# Altium schematic sheet Sensor_Board.SchDoc
size A3; ApprovedBy: -; CheckedBy: -; Engineer: Nasıf Can PELTEK; Revision: AA; SheetNumber: 5; SheetTotal: 7; releaseDate: -; changeDate: -; Department: Embedded; Size: A3; projeDescription: Wirless Security Dedector; fileName: Sensor_Board.ShcDoc
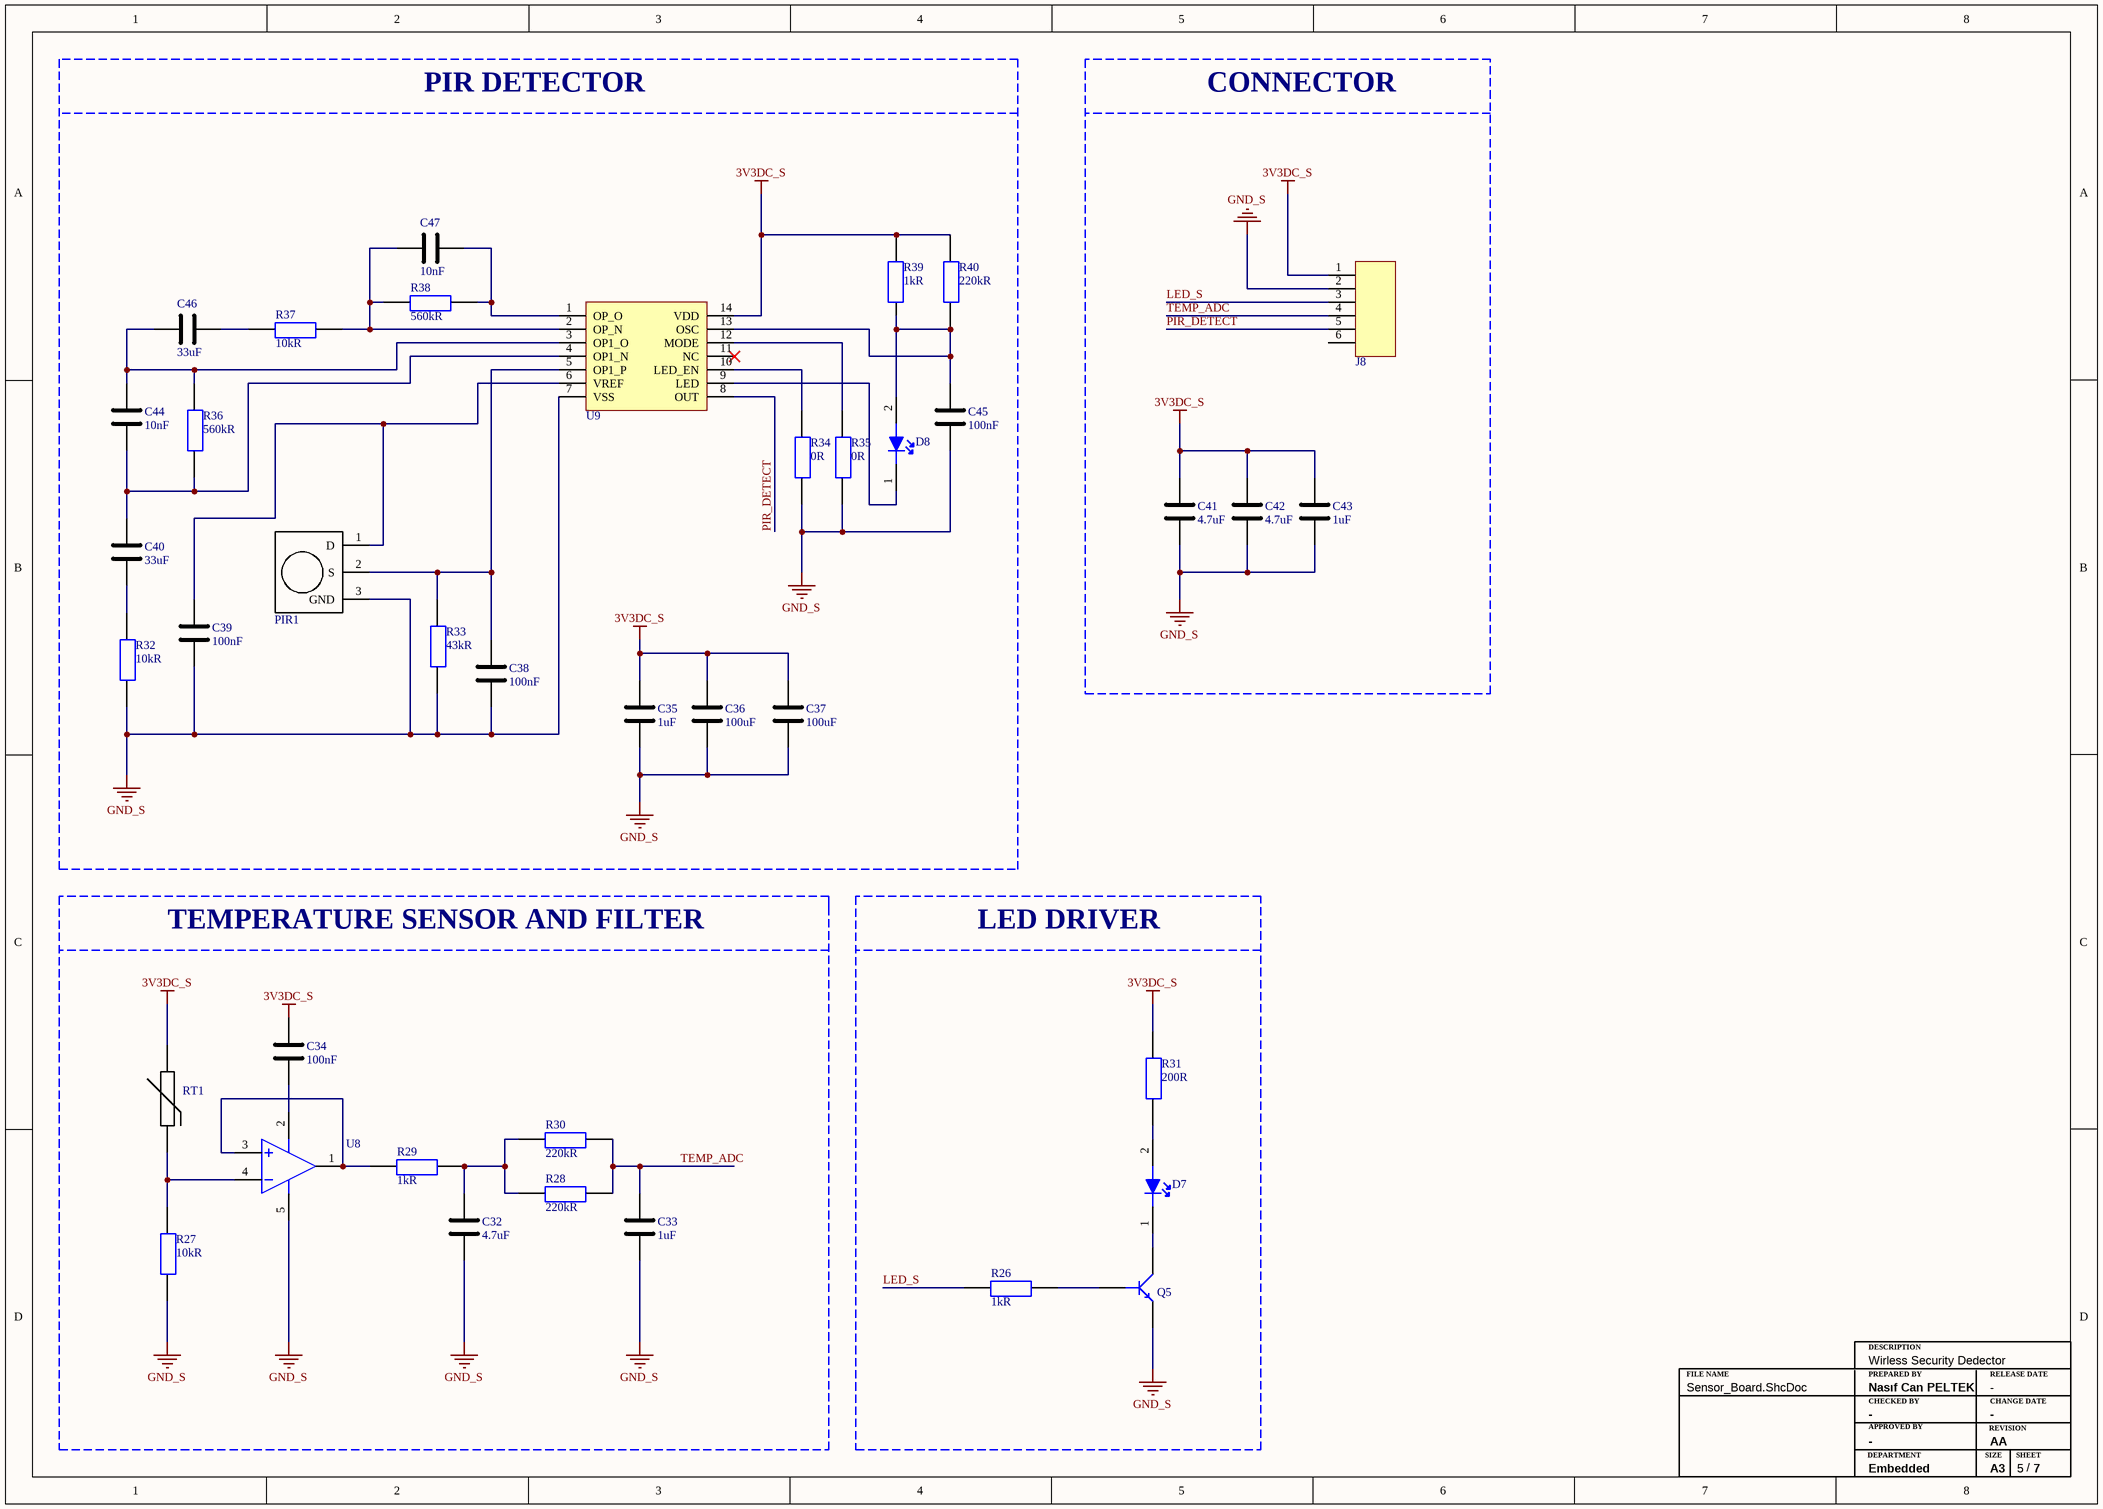
[diagram p0: Sensor_Board.SchDoc]

## Parts
C32  Capacitance: 4.7uF  [CAP_805]  (hidden comment: CL21A475KAQNNNE)
C33  Capacitance: 1uF  [CAP_805]  (hidden comment: CL21B105KBFNNNE)
C34  Capacitance: 100nF  [CAP_603]  (hidden comment: C0603C104K5RAC7867)
C35  Capacitance: 1uF  [CAP_805]  (hidden comment: CL21B105KBFNNNE)
C36  Capacitance: 100uF  [CAP_1206]  (hidden comment: 1210YD107MAT2A)
C37  Capacitance: 100uF  [CAP_1206]  (hidden comment: 1210YD107MAT2A)
C38  Capacitance: 100nF  [CAP_603]  (hidden comment: C0603C104K5RAC7867)
C39  Capacitance: 100nF  [CAP_603]  (hidden comment: C0603C104K5RAC7867)
C40  Capacitance: 33uF  [CAP_1206]  (hidden comment: C3216X5R1C336M160AB)
C41  Capacitance: 4.7uF  [CAP_805]  (hidden comment: CL21A475KAQNNNE)
C42  Capacitance: 4.7uF  [CAP_805]  (hidden comment: CL21A475KAQNNNE)
C43  Capacitance: 1uF  [CAP_805]  (hidden comment: CL21B105KBFNNNE)
C44  Capacitance: 10nF  [CAP_603]  (hidden comment: 0603B103K160CT)
C45  Capacitance: 100nF  [CAP_603]  (hidden comment: C0603C104K5RAC7867)
C46  Capacitance: 33uF  [CAP_1206]  (hidden comment: C3216X5R1C336M160AB)
C47  Capacitance: 10nF  [CAP_603]  (hidden comment: 0603B103K160CT)
D7  LTST-C171KRKT  [LED_RED_0805 (2012 Metric)]  (value not drawn)
D8  LTST-C171GKT  [LED_GREEN_0805 (2012 Metric) - duplicate]  (value not drawn)
J8  64800611622  [MALE_VERTICAL_6_PIN_CONNECTOR]  (value not drawn)
PIR1  LHI 878/3902  [LHI 878/3902]  (value not drawn)
Q5  MMBT3904-7-F  [SOT_23_3]  (value not drawn)
R26  Resistance: 1kR  [RES_603]  (hidden comment: RC0603FR-071KL)
R27  Resistance: 10kR  [RES_603]  (hidden comment: RES 10K 0603)
R28  Resistance: 220kR  [RES_603]  (hidden comment: RC0603JR-07220KL)
R29  Resistance: 1kR  [RES_603]  (hidden comment: RC0603FR-071KL)
R30  Resistance: 220kR  [RES_603]  (hidden comment: RC0603JR-07220KL)
R31  Resistance: 200R  [RES_603]  (hidden comment: RC0603JR-07200RL)
R32  Resistance: 10kR  [RES_603]  (hidden comment: RES 10K 0603)
R33  Resistance: 43kR  [RES_603]  (hidden comment: RC0603JR-0743KL)
R34  Resistance: 0R  [RES_603]  (hidden comment: RC0603JR-070RL)
R35  Resistance: 0R  [RES_603]  (hidden comment: RC0603JR-070RL)
R36  Resistance: 560kR  [RES_603]  (hidden comment: RC0603JR-07560KL)
R37  Resistance: 10kR  [RES_603]  (hidden comment: RES 10K 0603)
R38  Resistance: 560kR  [RES_603]  (hidden comment: RC0603JR-07560KL)
R39  Resistance: 1kR  [RES_603]  (hidden comment: RC0603FR-071KL)
R40  Resistance: 220kR  [RES_603]  (hidden comment: RC0603JR-07220KL)
RT1  TFPT1206L1002FM  [RES_1206]  (value not drawn)
U8  OPA314AIDBVR  [SOT_23_5]  (value not drawn)
U9  NCS36000DRG  [SOIC-14]  (value not drawn)

## Blocks framed on the sheet
PIR DETECTOR: C35-C40 C44-C47 D8 PIR1 R32-R40 U9
CONNECTOR: C41-C43 J8
LED DRIVER: D7 Q5 R26 R31

## Nets
3V3DC_S: C34.2 C35.2 C36.2 C37.2 C41.2 C42.2 C43.2 J8.1 R31.2 R39.1 R40.2 RT1.2 U9.14(VDD)
GND_S: C32.1 C33.1 C35.1 C36.1 C37.1 C38.1 C39.1 C41.1 C42.1 C43.1 C45.1 J8.2 PIR1.3(GND) Q5.2(E) R27.1 R32.1 R33.1 R34.1 R35.1 U8.5(V+) U9.7(VSS)
LED_S: J8.3 R26.1
PIR_DETECT: J8.5 U9.8(OUT)
TEMP_ADC: C33.2 J8.4 R28.2 R30.2
NetC32_2: C32.2 R28.1 R29.2 R30.1
NetC34_1: C34.1 U8.2(V-)
NetC38_2: C38.2 PIR1.2(S) R33.2 U9.5(OP1_P)
NetC39_2: C39.2 PIR1.1(D) U9.6(VREF)
NetC40_1: C40.1 R32.2
NetC40_2: C40.2 C44.1 R36.1 U9.4(OP1_N)
NetC44_2: C44.2 C46.1 R36.2 U9.3(OP1_O)
NetC45_2: C45.2 D8.2(ANODE(+)) R39.2 R40.1 U9.13(OSC)
NetC46_2: C46.2 R37.1
NetC47_1: C47.1 R37.2 R38.1 U9.2(OP_N)
NetC47_2: C47.2 R38.2 U9.1(OP_O)
NetD7_1: D7.1(CATHODE(-)) Q5.3(C)
NetD7_2: D7.2(ANODE(+)) R31.1
NetD8_1: D8.1(CATHODE(-)) U9.9(LED)
NetQ5_1: Q5.1(B) R26.2
NetR27_2: R27.2 RT1.1 U8.4(IN-)
NetR29_1: R29.1 U8.1(OUT) U8.3(IN+)
NetR34_2: R34.2 U9.10(LED_EN)
NetR35_2: R35.2 U9.12(MODE)

Not connected (* = marked no-connect by the designer): J8 6; U9 11(NC)*

## Notes on the sheet
- TEMPERATURE SENSOR AND FILTER
- FILE NAME
- PREPARED BY
- DESCRIPTION
- RELEASE DATE
- DEPARTMENT
- CHECKED BY
- APPROVED BY
- SIZE
- REVISION
- CHANGE DATE
- SHEET
- /

## Library data of the parts
C32 C41 C42 = CAP CER 4.7uF 0805: CAP CER 4.7UF 25V 10% 0805; Manufacturer: Samsung; Designed By: Nasıf Can Peltek; Dielectric: X5R; Supplier 1: Digi-Key; Manufacturer Part Number: CL21A475KAQNNNE; RoHS: Yes; Category: Ceramic Capacitors; Stock 1: 4205254; Pricing 1: 1=0,1, 10=0,073, 50=0,0414, 100=0,0344, 500=0,02408, 1000=0,01994 (USD); Mount: Surface Mount; Case/Package: 0805; Case Code (Metric): 2012; Case Code (Imperial): 0805; Min Operating Temperature: -55°C; Max Operating Temperature: 85°C; Packaging: Tape and Reel; Tolerance: 10%; Voltage Rating: 25V; Voltage Rating (DC): 25V; Series: CL; Construction: Flat; Length: 2mm; Height: 1.25mm; Depth: 1.25mm; Radiation Hardening: No; Lead Free: Lead Free; RoHS Compliant: Yes; ComponentLink1URL: https://datasheet.ciiva.com/25798/cl21a475kaqnnne-25798882.pdf?src-supplier=Digi-Key; ComponentLink1Description: https://datasheet.ciiva.com/25798/cl21a475kaqnnne-25798882.pdf?src-supplier=Digi-Key; Supplier Part Number 1: 1276-1244-1-ND
C33 C35 C43 = CAP CER 1uF 0805: CAP CER 1UF 50V 10% 0805; Manufacturer: Samsung; Designed By: Nasıf Can Peltek; Dielectric: X7R; Supplier 1: Digi-Key; Manufacturer Part Number: CL21B105KBFNNNE; RoHS: Yes; Category: Ceramic Capacitors; Stock 1: 1012576; Pricing 1: 1=0,11, 10=0,079, 50=0,045, 100=0,0373, 500=0,02616, 1000=0,02165 (USD); Mount: Surface Mount; Case/Package: 0805; Case Code (Metric): 2012; Case Code (Imperial): 0805; Min Operating Temperature: -55°C; Max Operating Temperature: 125°C; Tolerance: 10%; Packaging: Tape and Reel; Package Quantity: 1; Voltage Rating: 50V; Voltage: 50V; Series: CL; Construction: Flat; Length: 2mm; Width: 0.049inch; Height: 1.25mm; Thickness: 0.053inch; Depth: 1.25mm; Radiation Hardening: No; RoHS Compliant: Yes; ComponentLink1URL: https://datasheet.ciiva.com/25800/cl21b105kbfnnne-25800291.pdf?src-supplier=Digi-Key; ComponentLink1Description: https://datasheet.ciiva.com/25800/cl21b105kbfnnne-25800291.pdf?src-supplier=Digi-Key; Supplier Part Number 1: 1276-1029-1-ND
C34 C38 C39 C45 = CAP CER 100nF 0603: CAP CER 100nF 50V 10% SMD 0603; Manufacturer: KEMET; Manufacturer Part Number: C0603C104K5RACTU; Designed By: Nasıf Can Peltek; Dielectric Material: Ceramic; Dielectric: X7R; Dissipation Factor: 2.5%; Supplier 1: Digi-Key; RoHS: Yes; Category: Ceramic Capacitors; Stock 1: 12129532; Pricing 1: 1=0,11000, 10=0,07800, 50=0,04240, 100=0,03460, 500=0,02474, 1000=0,01944 (USD); Mount: Surface Mount; Case/Package: 0603; Number of Pins: 2; Case Code (Metric): 1608; Case Code (Imperial): 0603; Contact Plating: Tin,Matte; Min Operating Temperature: -55°C; Max Operating Temperature: 125°C; Tolerance: 10%; Voltage Rating (DC): 50V; Voltage Rating: 50V; Packaging: Tape and Reel; Package Quantity: 1; Termination: SMD/SMT; Voltage: 50V; Series: SMD Comm X7R; Length: 0.063inch; Width: 0.031inch; Height: 0.8mm; Thickness: 0.034inch; Lead Pitch: 0.7mm; Depth: 0.8mm; Radiation Hardening: No; Reach SVHC Compliant: Yes; RoHS Compliant: Yes; ComponentLink1URL: https://datasheet.ciiva.com/7823/kem-c1002-x7r-smd-7823591.pdf?src-supplier=Element14; ComponentLink1Description: https://datasheet.ciiva.com/7823/kem-c1002-x7r-smd-7823591.pdf?src-supplier=Element14; ComponentLink2URL: https://datasheet.ciiva.com/7823/kem-c1002-x7r-smd-7823592.pdf?src-supplier=Element14; ComponentLink2Description: https://datasheet.ciiva.com/7823/kem-c1002-x7r-smd-7823592.pdf?src-supplier=Element14; ComponentLink3URL: https://datasheet.ciiva.com/5999/kem-c1002-x7r-smd-5999400.pdf?src-supplier=Farnell; ComponentLink3Description: https://datasheet.ciiva.com/5999/kem-c1002-x7r-smd-5999400.pdf?src-supplier=Farnell; ComponentLink4URL: https://datasheet.ciiva.com/28645/1851736-28645640.pdf?src-supplier=Element14; ComponentLink4Description: https://datasheet.ciiva.com/28645/1851736-28645640.pdf?src-supplier=Element14; ComponentLink5URL: https://datasheet.ciiva.com/14585/70095383-14585209.pdf?src-supplier=Allied+Electronics; ComponentLink5Description: https://datasheet.ciiva.com/14585/70095383-14585209.pdf?src-supplier=Allied+Electronics; ComponentLink6URL: https://datasheet.ciiva.com/14602/70095383-14602583.pdf?src-supplier=Allied+Electronics; ComponentLink6Description: https://datasheet.ciiva.com/14602/70095383-14602583.pdf?src-supplier=Allied+Electronics; Supplier Part Number 1: 399-C0603C104K5RAC7867CT-ND
C36 C37 = CAP CER 100 uF 1206: CAP CER 100UF 16V 10%1206; Manufacturer: KEMET; Manufacturer Part Number: C0402C223K5RACTU; Designed By: Nasıf Can Peltek; Dielectric Material: Ceramic; Tolerance: 10%; Voltage Rating (DC): 50V; Dielectric: X7R; Dissipation Factor: 2.5%; Supplier 1: Digi-Key; RoHS: Yes; Category: Ceramic Capacitors; Stock 1: 316672; Pricing 1: 1=0,1, 10=0,07, 50=0,0382, 100=0,0312, 500=0,02228, 1000=0,0175, 2500=0,01591, 5000=0,01463 (USD); Mount: Surface Mount,PCB; Case/Package: 0402; Number of Pins: 2; Case Code (Metric): 1005; Case Code (Imperial): 0402; Contact Plating: Tin,Matte; Min Operating Temperature: -55°C; Max Operating Temperature: 125°C; Packaging: Tape and Reel; Series: C; Package Quantity: 1; Termination: SMD/SMT; Construction: Flat; Length: 1mm; Width: 0.5mm; Height: 0.5mm; Thickness: 0.022inch; Depth: 0.5mm; Radiation Hardening: No; RoHS Compliant: Yes; Reach SVHC Compliant: No; ComponentLink1URL: https://datasheet.ciiva.com/14598/70095383-14598149.pdf?src-supplier=Allied+Electronics; ComponentLink1Description: https://datasheet.ciiva.com/14598/70095383-14598149.pdf?src-supplier=Allied+Electronics; ComponentLink2URL: https://datasheet.ciiva.com/7747/40889-7747499.pdf?src-supplier=Element14; ComponentLink2Description: https://datasheet.ciiva.com/7747/40889-7747499.pdf?src-supplier=Element14; ComponentLink3URL: https://datasheet.ciiva.com/7747/40889-7747500.pdf?src-supplier=Element14; ComponentLink3Description: https://datasheet.ciiva.com/7747/40889-7747500.pdf?src-supplier=Element14; ComponentLink4URL: https://datasheet.ciiva.com/14609/70095383-14609037.pdf?src-supplier=Allied+Electronics; ComponentLink4Description: https://datasheet.ciiva.com/14609/70095383-14609037.pdf?src-supplier=Allied+Electronics; Supplier Part Number 1: 399-C0402C223K5RAC7867CT-ND; Voltage: 50V; Supplier 2: Digi-Key; Stock 2: 316672; Pricing 2: 1=0,1, 10=0,07, 50=0,0382, 100=0,0312, 500=0,02228, 1000=0,0175, 2500=0,01591, 5000=0,01463 (USD); Supplier Part Number 2: 399-C0402C223K5RAC7867DKR-ND; Voltage Rating: 16V; Supplier 3: Mouser; Stock 3: 72350; Pricing 3: 1=0,1, 10=0,054, 50=0,054, 100=0,025, 1000=0,014, 10000=0,013 (USD); Supplier Part Number 3: 80-C0402C223K5R
C40 C46 = CAP CER 33uF 1206: CAP CER 33uF 16V 20% SMD 1206; Manufacturer: TDK; Dielectric Material: Ceramic; Dielectric: X5R; Designed By: Nasıf Can Peltek; Supplier 1: Digi-Key; Manufacturer Part Number: C3216X5R1C336M160AB; RoHS: Yes; Category: Ceramic Capacitors; Stock 1: 113356; Pricing 1: 1=0,95, 10=0,722, 50=0,6, 100=0,5166, 500=0,39996, 1000=0,34441 (USD); Mount: Surface Mount; Case/Package: 1206; Case Code (Metric): 3216; Case Code (Imperial): 1206; Weight: 0.000571oz; Min Operating Temperature: -55°C; Max Operating Temperature: 85°C; Tolerance: 20%; Packaging: Tape and Reel; Voltage Rating (DC): 16V; Package Quantity: 2000; Voltage Rating: 16V; Termination: SMD/SMT; Series: C; Construction: Flat; Length: 3.2mm; Width: 1.6mm; Height: 1.6mm; Depth: 1.6mm; Radiation Hardening: No; Reach SVHC Compliant: No; Lead Free: Lead Free; RoHS Compliant: Yes; ComponentLink1URL: https://datasheet.ciiva.com/24219/c3216x5r1c336m160ab-265284-24219738.pdf?src-supplier=Mouser; ComponentLink1Description: https://datasheet.ciiva.com/24219/c3216x5r1c336m160ab-265284-24219738.pdf?src-supplier=Mouser; ComponentLink2URL: https://datasheet.ciiva.com/15192/getdatasheetpartid-714446-15192221.pdf?src-supplier=Verical; ComponentLink2Description: https://datasheet.ciiva.com/15192/getdatasheetpartid-714446-15192221.pdf?src-supplier=Verical; ComponentLink3URL: https://datasheet.ciiva.com/6285/tdkmlcccaprange-6285578.pdf?src-supplier=Digi-Key; ComponentLink3Description: https://datasheet.ciiva.com/6285/tdkmlcccaprange-6285578.pdf?src-supplier=Digi-Key; ComponentLink4URL: https://datasheet.ciiva.com/6285/tdkmlcccaprange-6285581.pdf?src-supplier=Digi-Key; ComponentLink4Description: https://datasheet.ciiva.com/6285/tdkmlcccaprange-6285581.pdf?src-supplier=Digi-Key; ComponentLink5URL: https://datasheet.ciiva.com/6285/tdkmlcccaprange-6285583.pdf?src-supplier=Digi-Key; ComponentLink5Description: https://datasheet.ciiva.com/6285/tdkmlcccaprange-6285583.pdf?src-supplier=Digi-Key; Supplier Part Number 1: 445-6002-1-ND
C44 C47 = CAP CER 10nF 0603: CAP CER 10nF 16V 10% SMD 0603; Manufacturer: Walsin Technologies; Designed By: Nasıf Can Peltek; Dielectric: X7R; Supplier 1: Digi-Key; Manufacturer Part Number: 0603B103K160CT; RoHS: Yes; Category: Ceramic Capacitors; Stock 1: 145123; Pricing 1: 1=0,1, 10=0,033, 50=0,0182, 100=0,0148, 500=0,0106, 1000=0,00833 (USD); Case Code (Metric): 1608; Case Code (Imperial): 0603; Min Operating Temperature: -55°C; Max Operating Temperature: 125°C; Tolerance: 10%; Packaging: Tape and Reel; Voltage Rating: 16V; Voltage Rating (DC): 16V; RoHS Compliant: Yes; Reach SVHC Compliant: Unknown; ComponentLink1URL: http://www.farnell.com/datasheets/1958513.pdf?src-supplier=Farnell; ComponentLink1Description: http://www.farnell.com/datasheets/1958513.pdf?src-supplier=Farnell; ComponentLink2URL: http://www.farnell.com/datasheets/1958513.pdf?src-supplier=Element14; ComponentLink2Description: http://www.farnell.com/datasheets/1958513.pdf?src-supplier=Element14; ComponentLink3URL: http://www.passivecomponent.com/wp-content/uploads/2018/10/MLCC.pdf?src-supplier=Digi-Key; ComponentLink3Description: http://www.passivecomponent.com/wp-content/uploads/2018/10/MLCC.pdf?src-supplier=Digi-Key; Supplier Part Number 1: 1292-1384-1-ND
D7 = LED RED 0805: LED RED CLEAR 0805 SMD; Manufacturer: Vishay Lite-On; Designed By: Nasıf Can Peltek; Lens Color: Colorless; Viewing Angle: 130°; Lens Style: Flat,Diffused,Colorless,Rectangular,Clear; Forward Current: 30mA; Forward Voltage: 2V; Luminous Intensity: 54mcd; Test Current: 20mA; Dominant Wavelength: 631nm; Number of Elements: 1; Power Dissipation: 75mW; Wavelength: 639nm; Reverse Voltage: 5V; Lens Size: 1.25mm; Supplier 1: Digi-Key; Manufacturer Part Number: LTST-C171KRKT; RoHS: Yes; Category: LEDs; Stock 1: 56581; Pricing 1: 1=0,28, 10=0,15, 100=0,0699, 500=0,0645, 1000=0,05052 (USD); Mount: Surface Mount; Case/Package: 0805; Number of Pins: 2; Color: Red; Case Code (Metric): 2012; Case Code (Imperial): 0805; Min Operating Temperature: -55°C; Max Operating Temperature: 85°C; Package Quantity: 3000; Packaging: Tape and Reel; Illumination Color: Red; Lens Transparency: Clear; Number of LEDs: 1; Series: -; Power Rating: 75mW; Length: 2mm; Width: 1.25mm; Height: 0.9mm; Depth: 1.25mm; Radiation Hardening: No; Lead Free: Lead Free; RoHS Compliant: Yes; ComponentLink1URL: https://datasheet.ciiva.com/12403/lite-on-ltst-c171krkt-187201-12403781.pdf?src-supplier=Mouser; ComponentLink1Description: https://datasheet.ciiva.com/12403/lite-on-ltst-c171krkt-187201-12403781.pdf?src-supplier=Mouser; ComponentLink2URL: https://datasheet.ciiva.com/16444/lite-on20ltst-c171krkt-16444779.pdf?src-supplier=Future+Electronics; ComponentLink2Description: https://datasheet.ciiva.com/16444/lite-on20ltst-c171krkt-16444779.pdf?src-supplier=Future+Electronics; ComponentLink3URL: https://datasheet.ciiva.com/11775/0900766b80dc0299-11775643.pdf?src-supplier=Rs; ComponentLink3Description: https://datasheet.ciiva.com/11775/0900766b80dc0299-11775643.pdf?src-supplier=Rs; ComponentLink4URL: https://datasheet.ciiva.com/2110/s-110-ltst-c171krkt-2110067.pdf?src-supplier=Digi-Key; ComponentLink4Description: https://datasheet.ciiva.com/2110/s-110-ltst-c171krkt-2110067.pdf?src-supplier=Digi-Key; ComponentLink5URL: https://datasheet.ciiva.com/2110/s-110-ltst-c171krkt-2110066.pdf?src-supplier=Digi-Key; ComponentLink5Description: https://datasheet.ciiva.com/2110/s-110-ltst-c171krkt-2110066.pdf?src-supplier=Digi-Key; ComponentLink6URL: https://datasheet.ciiva.com/2110/s-110-ltst-c171krkt-2110068.pdf?src-supplier=Digi-Key; ComponentLink6Description: https://datasheet.ciiva.com/2110/s-110-ltst-c171krkt-2110068.pdf?src-supplier=Digi-Key; Supplier Part Number 1: 160-1427-1-ND
D8 = LED GREEN 0805: LED GREEN CLEAR 0805 SMD; Manufacturer: Vishay Lite-On; Lens Color: Colorless; Viewing Angle: 130°; Lens Style: Flat,Diffused,Colorless,Rectangular,Clear; Luminous Intensity: 12mcd; Forward Current: 30mA; Forward Voltage: 2.1V; Power Rating: 100mW; Dominant Wavelength: 569nm; Test Current: 10mA; Number of Elements: 1; Wavelength: 585nm; Reverse Voltage: 5V; Lens Size: 1.25mm; Designed By: Nasıf Can Peltek; Supplier 1: Digi-Key; Manufacturer Part Number: LTST-C171GKT; RoHS: Yes; Category: LEDs; Stock 1: 4518; Pricing 1: 1=0,26, 10=0,141, 100=0,0656, 500=0,0606, 1000=0,04747 (USD); Mount: Surface Mount; Case/Package: 0805; Number of Pins: 2; Color: Green; Case Code (Metric): 2012; Case Code (Imperial): 0805; Min Operating Temperature: -55°C; Max Operating Temperature: 85°C; Package Quantity: 3000; Packaging: Tape and Reel; Illumination Color: Green; Lens Transparency: Clear; Power Dissipation: 100mW; Number of LEDs: 1; Series: -; Length: 2mm; Width: 1.25mm; Height: 0.9mm; Depth: 1.25mm; Radiation Hardening: No; Lead Free: Lead Free; RoHS Compliant: Yes; ComponentLink1URL: https://datasheet.ciiva.com/2110/ltst-c171gkt-2110000.pdf?src-supplier=Digi-Key; ComponentLink1Description: https://datasheet.ciiva.com/2110/ltst-c171gkt-2110000.pdf?src-supplier=Digi-Key; ComponentLink2URL: https://datasheet.ciiva.com/12400/lite-on-ltst-c171gkt-190133-12400647.pdf?src-supplier=Mouser; ComponentLink2Description: https://datasheet.ciiva.com/12400/lite-on-ltst-c171gkt-190133-12400647.pdf?src-supplier=Mouser; ComponentLink3URL: https://datasheet.ciiva.com/11773/0900766b80dc0296-11773991.pdf?src-supplier=Rs; ComponentLink3Description: https://datasheet.ciiva.com/11773/0900766b80dc0296-11773991.pdf?src-supplier=Rs; ComponentLink4URL: https://datasheet.ciiva.com/2110/ltst-c171gkt-2110001.pdf?src-supplier=Digi-Key; ComponentLink4Description: https://datasheet.ciiva.com/2110/ltst-c171gkt-2110001.pdf?src-supplier=Digi-Key; ComponentLink5URL: https://datasheet.ciiva.com/2110/ltst-c171gkt-2110002.pdf?src-supplier=Digi-Key; ComponentLink5Description: https://datasheet.ciiva.com/2110/ltst-c171gkt-2110002.pdf?src-supplier=Digi-Key; ComponentLink6URL: https://datasheet.ciiva.com/16396/ltst-c171gkt-16396549.pdf?src-supplier=Future+Electronics; ComponentLink6Description: https://datasheet.ciiva.com/16396/ltst-c171gkt-16396549.pdf?src-supplier=Future+Electronics; Supplier Part Number 1: 160-1423-1-ND
J8 = 64800611622_6PIN_CONN: Conn, Header, 6POS, 1ROW, 1.5MM;; Manufacturer: Wurth Electronics; Designed By: Nasıf Can Peltek; Supplier 1: DigiKey; Manufacturer Part Number: 64800611622; RoHS: No; Stock 1: 979; Pricing 1: 1=0,42, 50=0,406, 100=0,384, 250=0,361, 500=0,339 (USD); Supplier Part Number 1: 732-64800611622-ND; ComponentLink1Description: Data Link; ComponentLink1URL: https://www.we-online.com/en/components/products/WTB_1_50_MALE_VERTICAL_SHROUDED_HEADER_6480XX11622
PIR1 = LHI 878/3902: Sensor Pyro Detector Dual Motion; Manufacturer: Excelitas Technology; Designed By: Nasıf Can Peltek; Max Supply Voltage: 12; Min Supply Voltage: 2; Supplier 1: Newark; Manufacturer Part Number: LHI 878/3902; Supplier Part Number 1: 61T6571; Min Operating Temperature: -10; Max Operating Temperature: 40; Case/Package: LHI 878/3902; Number of Pins: 3; ComponentLink1Description: Data sheet; ComponentLink1URL: file:///C:/Users/OMEN/Downloads/PYD_1388___7083_Dual_Element_Pyrodetector_Datasheet.pdf; Category: Pyro Detector
Q5 = MMBT3904-7-F: NPN Ic=200mA Vceo=40V hfe=100~300 fT=310MHz P=300mW SOT-23; Manufacturer: Diodes Zetex; Designed By: Nasıf Can Peltek; Max Power Dissipation: 300mW; Collector Emitter Voltage (VCEO): 40V; Max Collector Current: 200mA; Collector Base Voltage (VCBO): 60V; Power Dissipation: 350mW; Frequency: 300MHz; hFE Min: 100; Number of Elements: 1; Emitter Base Voltage (VEBO): 6V; Collector Emitter Saturation Voltage: 300mV; Supplier 1: Digi-Key; Manufacturer Part Number: MMBT3904-7-F; RoHS: Yes; Category: BJTs; Stock 1: 6810874; Pricing 1: 1=0,12, 10=0,114, 100=0,0619, 500=0,03806, 1000=0,02596 (USD); Mount: Surface Mount; Case/Package: SOT-23; Number of Pins: 3; Weight: 0.000282oz; Min Operating Temperature: -55°C; Max Operating Temperature: 150°C; Polarity: NPN; Packaging: Tape and Reel; Package Quantity: 3000; Transition Frequency: 300MHz; Collector Emitter Breakdown Voltage: 40V; Max Breakdown Voltage: 40V; Continuous Collector Current: 200mA; Max Frequency: 300MHz; Gain Bandwidth Product: 300MHz; Voltage Rating (DC): 40V; Series: Automotive, AEC-Q101; Collector-emitter Voltage-Max: 300mV; Length: 3.05mm; Width: 1.4mm; Height: 1mm; Radiation Hardening: No; Reach SVHC Compliant: No; Lead Free: Lead Free; RoHS Compliant: Yes; ComponentLink1URL: https://datasheet.ciiva.com/11201/ds30036-11201778.pdf?src-supplier=Avnet; ComponentLink1Description: https://datasheet.ciiva.com/11201/ds30036-11201778.pdf?src-supplier=Avnet; ComponentLink2URL: https://datasheet.ciiva.com/15138/getdatasheetpartid-53265-15138780.pdf?src-supplier=Verical; ComponentLink2Description: https://datasheet.ciiva.com/15138/getdatasheetpartid-53265-15138780.pdf?src-supplier=Verical; ComponentLink3URL: https://datasheet.ciiva.com/22711/1915516-22711750.pdf?src-supplier=Element14; ComponentLink3Description: https://datasheet.ciiva.com/22711/1915516-22711750.pdf?src-supplier=Element14; ComponentLink4URL: https://datasheet.ciiva.com/11198/ds30036-11198999.pdf?src-supplier=Avnet; ComponentLink4Description: https://datasheet.ciiva.com/11198/ds30036-11198999.pdf?src-supplier=Avnet; ComponentLink5URL: https://datasheet.ciiva.com/6361/ds30036-6361256.pdf?src-supplier=Digi-Key; ComponentLink5Description: https://datasheet.ciiva.com/6361/ds30036-6361256.pdf?src-supplier=Digi-Key; ComponentLink6URL: https://datasheet.ciiva.com/6361/ds30036-6361254.pdf?src-supplier=Digi-Key; ComponentLink6Description: https://datasheet.ciiva.com/6361/ds30036-6361254.pdf?src-supplier=Digi-Key; Supplier Part Number 1: MMBT3904-FDICT-ND
R26 R29 R39 = RES 1K 0603: RES SMD 1K OHM 1%  0603 SMD; Manufacturer: Yageo; Temperature Coefficient: 100ppm/°C; Power Rating: 100mW; Voltage Rating: 50V; Designed By: Nasıf Can Peltek; Supplier 1: Digi-Key; Manufacturer Part Number: RC0603FR-071KL; RoHS: Yes; Category: Chip SMD Resistors; Stock 1: 23406621; Pricing 1: 1=0,1, 10=0,019, 50=0,0114, 100=0,0094, 500=0,00628, 1000=0,00537 (USD); Case/Package: 0603; Contact Plating: Tin,Matte; Case Code (Imperial): 0603; Case Code (Metric): 1608; Size Code: 0603; Min Operating Temperature: -55°C; Max Operating Temperature: 155°C; Tolerance: 1%; Resistor Type: Thick Film; Packaging: Tape and Reel; Termination: SMD/SMT; Features: Moisture Resistant; Series: RC; Max Power Dissipation: 100mW; Number of Terminations: 2; Technology: THICK FILM; Resistance Tolerance: 1%; Construction: Rectangular; Length: 1.6mm; Height: 0.45mm; Depth: 0.8mm; Reach SVHC Compliant: No; Lead Free: Lead Free; Military Standard: Not; RoHS Compliant: Yes; Supplier Part Number 1: 311-1.00KHRCT-ND
R27 R32 R37 = RES 10K 0603: RES SMD 10K OHM 1% 1/10W 0603 SMD; Manufacturer: Yageo; Manufacturer Part Number: RC0603FR-0710KL; Designed By: Nasıf Can Peltek; Temperature Coefficient: 100ppm/°C; Voltage Rating (DC): 50V; Power Rating: 100mW; Voltage Rating: 75V; Supplier 1: Digi-Key; RoHS: Yes; Category: Chip SMD Resistors; Stock 1: 37104838; Pricing 1: 1=0,10000, 10=0,01900, 100=0,00770, 1000=0,00345, 2500=0,00300 (USD); Case/Package: 0603; Number of Pins: 2; Case Code (Imperial): 0603; Case Code (Metric): 1608; Size Code: 0603; Weight: 7.1E-05oz; Min Operating Temperature: -55°C; Max Operating Temperature: 155°C; Packaging: Tape and Reel; Tolerance: 1%; Resistor Type: Thick Film; Termination: SMD/SMT; Features: Moisture Resistant; Series: RC; Max Power Dissipation: 100mW; Number of Terminations: 2; Resistance Tolerance: 1%; Construction: Rectangular; Length: 1.6mm; Width: 0.8mm; Height: 0.45mm; Depth: 0.8mm; Lead Pitch: 0.3mm; Reach SVHC Compliant: Yes; Lead Free: Lead Free; Military Standard: Not; RoHS Compliant: Yes; Supplier Part Number 1: 311-10.0KHRDKR-ND
R28 R30 R40 = RES 220K 0603: RES SMD 220K OHM 5% 0603 SMD; Manufacturer: Yageo; Temperature Coefficient: 100ppm/°C; Voltage Rating (DC): 50V; Power Rating: 100mW; Designed By: Nasıf Can Peltek; Supplier 1: Digi-Key; Manufacturer Part Number: RC0603JR-07220KL; RoHS: Yes; Category: Chip SMD Resistors; Stock 1: 1100000; Pricing 1: 5000=0,00314, 10000=0,00275, 25000=0,00236, 35000=0,00228, 50000=0,00211, 125000=0,00191 (USD); Case/Package: 0603; Number of Pins: 2; Case Code (Imperial): 0603; Case Code (Metric): 1608; Size Code: 0603; Min Operating Temperature: -55°C; Max Operating Temperature: 155°C; Resistor Type: Thick Film; Tolerance: 5%; Packaging: Tape and Reel; Voltage Rating: 50V; Package Quantity: 1; Termination: SMD/SMT; Number of Terminations: 2; Max Power Dissipation: 100mW; Features: Moisture Resistant; Series: RC; Construction: Rectangular; Resistance Tolerance: 5%; Length: 0.063inch; Width: 0.031inch; Height: 0.022inch; Depth: 0.8mm; Reach SVHC Compliant: No; Lead Free: Lead Free; RoHS Compliant: Yes; Military Standard: Not; ComponentLink1URL: https://datasheet.ciiva.com/2452/pyu-r-int-thick-7-2452924.pdf?src-supplier=Digi-Key; ComponentLink1Description: https://datasheet.ciiva.com/2452/pyu-r-int-thick-7-2452924.pdf?src-supplier=Digi-Key; ComponentLink2URL: https://datasheet.ciiva.com/2452/pyu-r-int-thick-7-2452925.pdf?src-supplier=Digi-Key; ComponentLink2Description: https://datasheet.ciiva.com/2452/pyu-r-int-thick-7-2452925.pdf?src-supplier=Digi-Key; ComponentLink3URL: https://datasheet.ciiva.com/2452/pyu-r-int-thick-7-2452923.pdf?src-supplier=Digi-Key; ComponentLink3Description: https://datasheet.ciiva.com/2452/pyu-r-int-thick-7-2452923.pdf?src-supplier=Digi-Key; Supplier Part Number 1: 311-220KGRTR-ND
R31 = RES 200 Ohm 0603: RES SMD 220Ohm OHM 5% 0603 SMD; Manufacturer: Yageo; Designed By: Nasıf Can Peltek; Temperature Coefficient: 100ppm/°C; Voltage Rating (DC): 50V; Power Rating: 100mW; Voltage Rating: 75V; Supplier 1: Digi-Key; Manufacturer Part Number: RC0603JR-07200RL; RoHS: Yes; Category: Chip SMD Resistors; Stock 1: 1694484; Pricing 1: 1=0,1, 10=0,015, 50=0,0094, 100=0,0077, 500=0,00516, 1000=0,00441 (USD); Case/Package: 0603; Number of Pins: 2; Case Code (Metric): 1608; Case Code (Imperial): 0603; Weight: 7.1E-05oz; Size Code: 0603; Min Operating Temperature: -55°C; Max Operating Temperature: 155°C; Tolerance: 5%; Resistor Type: Thick Film; Packaging: Tape and Reel; Package Quantity: 1; Number of Terminations: 2; Termination: SMD/SMT; Max Power Dissipation: 100mW; Features: Moisture Resistant; Series: RC; Resistance Tolerance: 5%; Length: 0.063inch; Width: 0.031inch; Height: 0.022inch; Lead Free: Lead Free; Reach SVHC Compliant: No; RoHS Compliant: Yes; ComponentLink1URL: https://datasheet.ciiva.com/2453/pyu-r-int-thick-7-2453104.pdf?src-supplier=Digi-Key; ComponentLink1Description: https://datasheet.ciiva.com/2453/pyu-r-int-thick-7-2453104.pdf?src-supplier=Digi-Key; ComponentLink2URL: https://datasheet.ciiva.com/2453/pyu-r-int-thick-7-2453105.pdf?src-supplier=Digi-Key; ComponentLink2Description: https://datasheet.ciiva.com/2453/pyu-r-int-thick-7-2453105.pdf?src-supplier=Digi-Key; ComponentLink3URL: https://datasheet.ciiva.com/2453/pyu-r-int-thick-7-2453103.pdf?src-supplier=Digi-Key; ComponentLink3Description: https://datasheet.ciiva.com/2453/pyu-r-int-thick-7-2453103.pdf?src-supplier=Digi-Key; Supplier Part Number 1: 311-200GRCT-ND
R33 = RES 43K 0603: RES SMD 43K OHM 5% 0603 SMD; Manufacturer: Yageo; Designed By: Nasıf Can Peltek; Voltage Rating: 75V; Power Rating: 100mW; Temperature Coefficient: 100ppm/°C; Voltage Rating (DC): 50V; Supplier 1: Digi-Key; Manufacturer Part Number: RC0603JR-0743KL; RoHS: Yes; Category: Chip SMD Resistors; Stock 1: 307218; Pricing 1: 1=0,1, 10=0,015, 100=0,0076, 1000=0,00437, 2500=0,0036 (USD); Case/Package: 0603; Case Code (Imperial): 0603; Case Code (Metric): 1608; Weight: 7.1E-05oz; Min Operating Temperature: -55°C; Max Operating Temperature: 155°C; Tolerance: 5%; Packaging: Tape and Reel; Package Quantity: 1; Termination: SMD/SMT; Number of Terminations: 2; Max Power Dissipation: 100mW; Working Voltage: 75V; Features: Moisture Resistant; Series: RC; Technology: THICK FILM; Length: 0.063inch; Width: 0.031inch; Height: 0.022inch; Lead Free: Lead Free; RoHS Compliant: Yes; ComponentLink1URL: https://datasheet.ciiva.com/2453/pyu-r-int-thick-7-2453053.pdf?src-supplier=Digi-Key; ComponentLink1Description: https://datasheet.ciiva.com/2453/pyu-r-int-thick-7-2453053.pdf?src-supplier=Digi-Key; ComponentLink2URL: https://datasheet.ciiva.com/2453/pyu-r-int-thick-7-2453054.pdf?src-supplier=Digi-Key; ComponentLink2Description: https://datasheet.ciiva.com/2453/pyu-r-int-thick-7-2453054.pdf?src-supplier=Digi-Key; ComponentLink3URL: https://datasheet.ciiva.com/2453/pyu-r-int-thick-7-2453052.pdf?src-supplier=Digi-Key; ComponentLink3Description: https://datasheet.ciiva.com/2453/pyu-r-int-thick-7-2453052.pdf?src-supplier=Digi-Key; Supplier Part Number 1: 311-43KGRCT-ND
R34 R35 = RES 0R 0603: RES SMD 0 OHM JUMPER 1/10W 0603; Manufacturer: Yageo; Tolerance: 1%; Power Rating: 100mW; Voltage Rating (DC): 50V; Temperature Coefficient: 200ppm/°C; Resistance Tolerance: 5%; Designed By: Nasıf Can Peltek; Supplier 1: Digi-Key; Manufacturer Part Number: RC0603JR-070RL; RoHS: Yes; Category: Chip SMD Resistors; Stock 1: 10516283; Pricing 1: 1=0,1, 10=0,016, 25=0,0112, 50=0,0086, 100=0,0063, 250=0,0048, 500=0,00386, 1000=0,00284 (USD); Case/Package: 0603; Number of Pins: 2; Contact Plating: Tin,Matte; Case Code (Imperial): 0603; Case Code (Metric): 1608; Size Code: 0603; Min Operating Temperature: -55°C; Max Operating Temperature: 155°C; Resistor Type: Thick Film; Packaging: Tape and Reel; Termination: SMD/SMT; Series: RC; Technology: THICK FILM; Package Quantity: 5000; Voltage Rating: 50V; Features: Moisture Resistant; Max Power Dissipation: 100mW; Number of Terminations: 2; Construction: Rectangular; Length: 1.6mm; Width: 0.8mm; Height: 0.45mm; Depth: 0.8mm; Lead Free: Lead Free; RoHS Compliant: Yes; Reach SVHC Compliant: Unknown; Military Standard: Not; Supplier Part Number 1: 311-0.0GRCT-ND
R36 R38 = RES 560K 0603: RES 156K OHM 5% 0603 SMD; Manufacturer: Yageo; Power Rating: 100mW; Voltage Rating: 75V; Voltage Rating (DC): 50V; Temperature Coefficient: 100ppm/°C; Designed By: Nasıf Can Peltek; Supplier 1: Digi-Key; Manufacturer Part Number: RC0603JR-07560KL; RoHS: Yes; Category: Chip SMD Resistors; Stock 1: 505021; Pricing 1: 1=0,1, 10=0,015, 100=0,0076, 1000=0,00437, 2500=0,0036 (USD); Case/Package: 0603; Number of Pins: 2; Case Code (Metric): 1608; Case Code (Imperial): 0603; Weight: 7.1E-05oz; Min Operating Temperature: -55°C; Max Operating Temperature: 155°C; Package Quantity: 1; Tolerance: 5%; Packaging: Tape and Reel; Resistor Type: Thick Film; Number of Terminations: 2; Termination: SMD/SMT; Max Power Dissipation: 100mW; Working Voltage: 75V; Features: Moisture Resistant; Series: RC; Resistance Tolerance: 5%; Technology: THICK FILM; Length: 0.063inch; Width: 0.8mm; Height: 0.022inch; Lead Free: Lead Free; RoHS Compliant: Yes; Reach SVHC Compliant: Unknown; ComponentLink1URL: https://datasheet.ciiva.com/2453/pyu-r-int-thick-7-2453056.pdf?src-supplier=Digi-Key; ComponentLink1Description: https://datasheet.ciiva.com/2453/pyu-r-int-thick-7-2453056.pdf?src-supplier=Digi-Key; ComponentLink2URL: https://datasheet.ciiva.com/2453/pyu-r-int-thick-7-2453057.pdf?src-supplier=Digi-Key; ComponentLink2Description: https://datasheet.ciiva.com/2453/pyu-r-int-thick-7-2453057.pdf?src-supplier=Digi-Key; ComponentLink3URL: https://datasheet.ciiva.com/2453/pyu-r-int-thick-7-2453055.pdf?src-supplier=Digi-Key; ComponentLink3Description: https://datasheet.ciiva.com/2453/pyu-r-int-thick-7-2453055.pdf?src-supplier=Digi-Key; Supplier Part Number 1: 311-560KGRCT-ND
RT1 = TFPT1206L1002FM: Thermistor PTC 10K Ohm 1% 2-Pin 1206 Surface Mount Solder Pad T/R Automotive; Manufacturer: Vishay Dale; Designed By: Nasıf Can Peltek; Resistance: 10kR; Power Rating: 125mW; Voltage: 40V; Supplier 1: Digi-Key; Manufacturer Part Number: TFPT1206L1002FM; RoHS: Yes; Category: Thermistors; Pricing 1: 1=1,35, 5=1,296, 10=1,054, 25=0,9076, 50=0,7862, 100=0,7133, 500=0,59978, 1000=0,53495 (USD); Mount: Surface Mount; Case/Package: 1206; Case Code (Imperial): 1206; Min Operating Temperature: -55°C; Max Operating Temperature: 125°C; Packaging: Tape and Reel; Package Quantity: 5000; Tolerance: 1%; Max Power Dissipation: 125mW; Termination: SMD/SMT; Series: TFPT; Resistance Tolerance: 1%; Length: 3.2mm; Width: 1.6mm; Height: 0.55mm; Lead Free: Lead Free; RoHS Compliant: Yes; ComponentLink1URL: https://datasheet.ciiva.com/2852/tfpt-2852076.pdf?src-supplier=Digi-Key; ComponentLink1Description: https://datasheet.ciiva.com/2852/tfpt-2852076.pdf?src-supplier=Digi-Key; Supplier Part Number 1: 541-3533-1-ND
U8 = OPA314AIDBVR: IC OPAMP GP 3MHZ RRO SOT23-5; Manufacturer: Texas Instruments; Min Supply Voltage: 1.8V; Max Supply Voltage: 5.5V; Min Dual Supply Voltage: 900mV; Max Dual Supply Voltage: 2.75V; Voltage Gain: 128dB; Common Mode Rejection Ratio: 75dB; Output Current: 20mA; Number of Channels: 1; Slew Rate: 1.5V/µs; Max I/O Voltage: 2.5mV; Input Bias Current: 10pA; Operating Supply Current: 150uA; Power Supply Rejection Ratio (PSRR): 78dB; Amplifier Type: GENERAL PURPOSE; Designed By: Nasıf Can Peltek; Supplier 1: Digi-Key; Manufacturer Part Number: OPA314AIDBVR; RoHS: Yes; Category: Amplifiers - Op Amps, Buffer, Instrumentation; Stock 1: 2036; Pricing 1: 1=1,18, 10=1,054, 25=1,0008, 100=0,822, 250=0,76844, 500=0,67908, 1000=0,53612 (USD); Case/Package: SOT-23-5; Number of Pins: 5; Min Operating Temperature: -40°C; Max Operating Temperature: 125°C; Gain Bandwidth Product: 3MHz; Package Quantity: 1; Packaging: Tape and Reel; Unity Gain Bandwidth Product: 3MHz; Nominal Gain Bandwidth Product: 3MHz; Input Offset Voltage (Vos): 2.5mV; Number of Circuits: 1; Output Current per Channel: 20mA; Number of Elements: 1; Supply Current: 150uA; Series: -; Technology: CMOS; Radiation Hardening: No; Lead Free: Lead Free; RoHS Compliant: Yes; ComponentLink1URL: https://datasheet.ciiva.com/29638/opa314-29638827.pdf?src-supplier=Digi-Key; ComponentLink1Description: https://datasheet.ciiva.com/29638/opa314-29638827.pdf?src-supplier=Digi-Key; ComponentLink2URL: https://datasheet.ciiva.com/14462/opa2314-14462006.pdf?src-supplier=Avnet; ComponentLink2Description: https://datasheet.ciiva.com/14462/opa2314-14462006.pdf?src-supplier=Avnet; ComponentLink3URL: https://datasheet.ciiva.com/14456/opa2314-14456281.pdf?src-supplier=Avnet; ComponentLink3Description: https://datasheet.ciiva.com/14456/opa2314-14456281.pdf?src-supplier=Avnet; Supplier Part Number 1: 296-36699-1-ND
U9 = NCS36000: (PIR) Infrared Detector Controller NCS36000 Series Single 5.5V Passive - SOIC-14; Manufacturer: ON Semiconductor; Manufacturer Part Number: NCS36000DG; Designed By: Nasıf Can Peltek; Operating Supply Current: 50uA; Output Type: Digital,PUSH-PULL; Input Type: DIGITAL; Operating Supply Voltage: 5.75V; Voltage Gain: 80dB; Output Current: 25uA; Max Frequency: 62.5Hz; Amplifier Type: LOW NOISE; Supplier 1: Digi-Key; RoHS: Yes; Category: Amplifiers - Op Amps, Buffer, Instrumentation; Stock 1: 453; Pricing 1: 1=1,04, 10=0,934, 25=0,8864, 100=0,728, 250=0,68052, 500=0,60138, 1000=0,47477, 2500=0,44312, 5000=0,42097 (USD); Case/Package: SOIC; Number of Pins: 14; Min Operating Temperature: -40°C; Max Operating Temperature: 85°C; Package Quantity: 55; Packaging: Rail/Tube; Series: -; Length: 8.75mm; Width: 4mm; Height: 1.75mm; Lead Free: Lead Free; Halogen Free: Halogen Free; RoHS Compliant: Yes; ComponentLink1URL: https://datasheet.ciiva.com/2965/ncs36000-d-2965211.pdf?src-supplier=Avnet; ComponentLink1Description: https://datasheet.ciiva.com/2965/ncs36000-d-2965211.pdf?src-supplier=Avnet; ComponentLink2URL: https://datasheet.ciiva.com/25629/0900766b810de37b-25629154.pdf?src-supplier=Rs; ComponentLink2Description: https://datasheet.ciiva.com/25629/0900766b810de37b-25629154.pdf?src-supplier=Rs; ComponentLink3URL: https://datasheet.ciiva.com/1782/ncs36000-d-1782043.pdf?src-supplier=Digi-Key; ComponentLink3Description: https://datasheet.ciiva.com/1782/ncs36000-d-1782043.pdf?src-supplier=Digi-Key; Supplier Part Number 1: NCS36000DGOS-ND